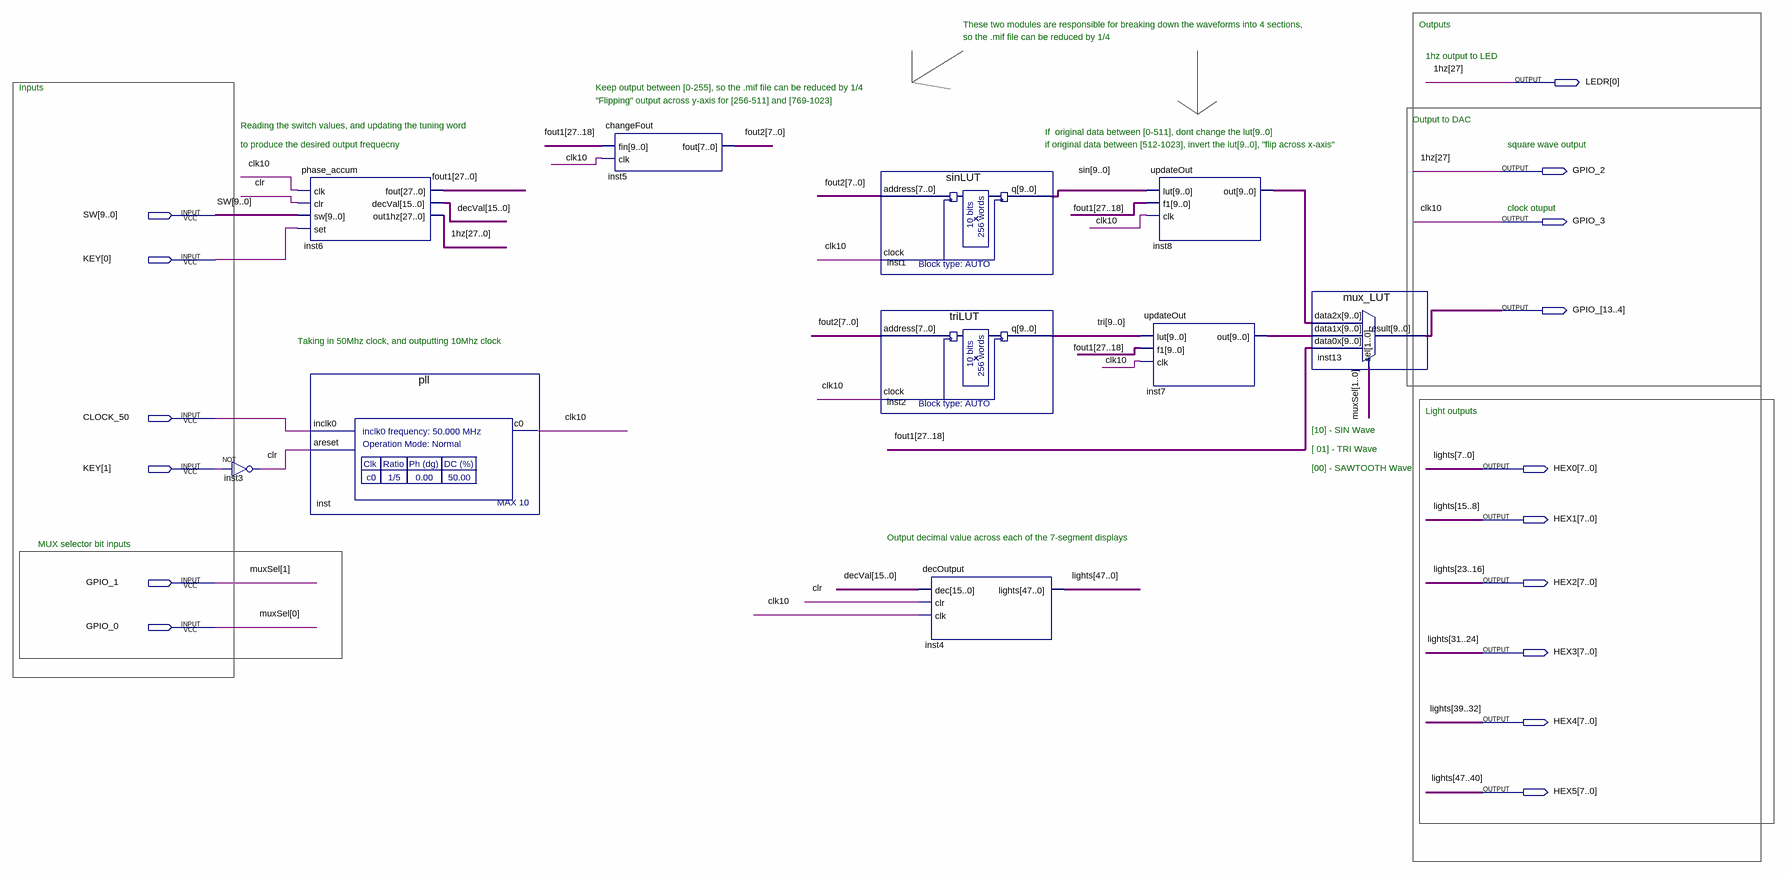
[diagram p0: schematic sheet]
// Quartus schematic dds_fsk.bdf as structural Verilog: 10 symbols, 16 pins
module dds_fsk (
  input  [9:0] SW,
  input  [1:0] KEY,
  input  CLOCK_50,
  input  GPIO_1,
  input  GPIO_0,
  output [0:0] LEDR,
  output GPIO_2,
  output GPIO_3,
  output [13:4] GPIO_,
  output [7:0] HEX0,
  output [7:0] HEX1,
  output [7:0] HEX2,
  output [7:0] HEX3,
  output [7:0] HEX4,
  output [7:0] HEX5
);

  wire clr;
  wire [7:0] fout2;
  wire [9:0] inst7_out, inst8_out, sin, \tri ;
  wire [15:0] decVal;
  wire [26:0] \1hz ;
  wire [27:0] fout1;

  not inst3 (clr, KEY[1]);
  phase_accum inst6 (
    .clk(GPIO_3), .clr(clr), .sw(SW), .set(KEY[0]), .fout(fout1), .decVal(decVal), .out1hz({GPIO_2, \1hz }));
  pll inst (.inclk0(CLOCK_50), .areset(clr), .c0(GPIO_3));
  changeFout inst5 (.fin(fout1[27:18]), .clk(GPIO_3), .fout(fout2));
  sinLUT inst1 (.address(fout2), .clock(GPIO_3), .q(sin));
  triLUT inst2 (.address(fout2), .clock(GPIO_3), .q(\tri ));
  decOutput inst4 (.dec(decVal), .clr(clr), .clk(GPIO_3), .lights({HEX5, HEX4, HEX3, HEX2, HEX1, HEX0}));
  updateOut inst7 (.lut(\tri ), .f1(fout1[27:18]), .clk(GPIO_3), .out(inst7_out));
  updateOut inst8 (.lut(sin), .f1(fout1[27:18]), .clk(GPIO_3), .out(inst8_out));
  mux_LUT inst13 (
    .data2x(inst8_out), .data1x(inst7_out), .data0x(fout1[27:18]), .sel({GPIO_1, GPIO_0}), .result(GPIO_));

  assign LEDR[0] = GPIO_2;

  // Other names for the same wires on the sheet: 1hz[27] = GPIO_2; clk10 = GPIO_3;
  //   lights[47:0] = {HEX5, HEX4, HEX3, HEX2, HEX1, HEX0}; muxSel[1:0] = {GPIO_1, GPIO_0}

  // Notes on the sheet:
  //   These two modules are responsible for breaking down the waveforms into 4 sections,
  //   Outputs
  //   so the .mif file can be reduced by 1/4
  //   1hz output to LED
  //   Inputs
  //   Keep output between [0-255], so the .mif file can be reduced by 1/4
  //   "Flipping" output across y-axis for [256-511] and [769-1023]
  //   Output to DAC
  //   Reading the switch values, and updating the tuning word 
  //   If  original data between [0-511], dont change the lut[9..0]
  //   to produce the desired output frequecny
  //   if original data between [512-1023], invert the lut[9..0], "flip across x-axis"
  //   square wave output
  //   clock otuput
  //   Taking in 50Mhz clock, and outputting 10Mhz clock
  //   Light outputs
  //   [10] - SIN Wave
  //   [ 01] - TRI Wave
  //   [00] - SAWTOOTH Wave
  //   Output decimal value across each of the 7-segment displays
  //   MUX selector bit inputs
endmodule
